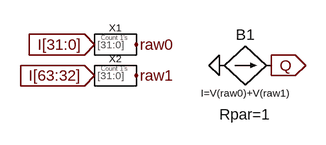
[diagram p0: schematic 1counter_64bit-fast.asc]
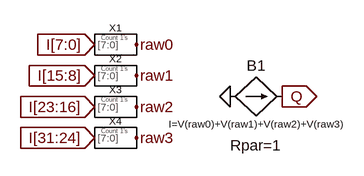
[diagram p1: sub-circuit 1counter_32bit-fast.asc]
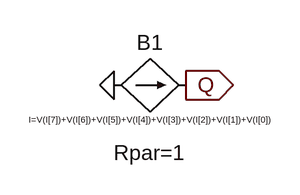
[diagram p2: sub-circuit 1counter_8bit-fast.asc]
1counter_64bit-fast.asc, the LTspice schematic file:
Version 4
SHEET 1 880 680
FLAG 432 176 Q
IOPIN 432 176 Out
FLAG 160 144 I[31:0]
IOPIN 160 144 In
FLAG 160 192 I[63:32]
IOPIN 160 192 In
FLAG 224 144 raw0
FLAG 224 192 raw1
FLAG 352 176 0
SYMBOL bi 352 176 R270
WINDOW 0 32 40 VTop 2
WINDOW 3 -32 40 VBottom 1
WINDOW 123 -60 40 VBottom 2
SYMATTR InstName B1
SYMATTR Value I=V(raw0)+V(raw1)
SYMATTR Value2 Rpar=1
SYMBOL 1counter_32bit-fast 192 144 R0
SYMATTR InstName X1
SYMBOL 1counter_32bit-fast 192 192 R0
SYMATTR InstName X2

1counter_32bit-fast.asc, the sub-circuit schematic file:
Version 4
SHEET 1 880 680
FLAG 432 176 Q
IOPIN 432 176 Out
FLAG 144 96 I[7:0]
IOPIN 144 96 In
FLAG 144 144 I[15:8]
IOPIN 144 144 In
FLAG 144 192 I[23:16]
IOPIN 144 192 In
FLAG 144 240 I[31:24]
IOPIN 144 240 In
FLAG 208 96 raw0
FLAG 208 144 raw1
FLAG 208 192 raw2
FLAG 208 240 raw3
FLAG 352 176 0
SYMBOL 1counter_8bit-fast 176 96 R0
SYMATTR InstName X1
SYMBOL 1counter_8bit-fast 176 144 R0
SYMATTR InstName X2
SYMBOL 1counter_8bit-fast 176 192 R0
SYMATTR InstName X3
SYMBOL 1counter_8bit-fast 176 240 R0
SYMATTR InstName X4
SYMBOL bi 352 176 R270
WINDOW 0 32 40 VTop 2
WINDOW 3 -32 40 VBottom 1
WINDOW 123 -60 40 VBottom 2
SYMATTR InstName B1
SYMATTR Value I=V(raw0)+V(raw1)+V(raw2)+V(raw3)
SYMATTR Value2 Rpar=1

1counter_8bit-fast.asc, the sub-circuit schematic file:
Version 4
SHEET 1 880 680
FLAG 320 128 Q
IOPIN 320 128 Out
FLAG 240 128 0
SYMBOL bi 240 128 R270
WINDOW 0 32 40 VTop 2
WINDOW 3 -32 40 VBottom 0
WINDOW 123 -60 40 VBottom 2
SYMATTR InstName B1
SYMATTR Value I=V(I[7])+V(I[6])+V(I[5])+V(I[4])+V(I[3])+V(I[2])+V(I[1])+V(I[0])
SYMATTR Value2 Rpar=1

The netlist it stands for:
* 1counter_64bit-fast.asc
B1 0 Q I=V(raw0)+V(raw1) Rpar=1
XX1 I[31] I[30] I[29] I[28] I[27] I[26] I[25] I[24] I[23] I[22] I[21] I[20] I[19] I[18] I[17] I[16] I[15] I[14] I[13] I[12] I[11] I[10] I[9] I[8] I[7] I[6] I[5] I[4] I[3] I[2] I[1] I[0] raw0 1counter_32bit-fast
XX2 I[63] I[62] I[61] I[60] I[59] I[58] I[57] I[56] I[55] I[54] I[53] I[52] I[51] I[50] I[49] I[48] I[47] I[46] I[45] I[44] I[43] I[42] I[41] I[40] I[39] I[38] I[37] I[36] I[35] I[34] I[33] I[32] raw1 1counter_32bit-fast

* block symbol definitions
.subckt 1counter_32bit-fast I[31] I[30] I[29] I[28] I[27] I[26] I[25] I[24] I[23] I[22] I[21] I[20] I[19] I[18] I[17] I[16] I[15] I[14] I[13] I[12] I[11] I[10] I[9] I[8] I[7] I[6] I[5] I[4] I[3] I[2] I[1] I[0] Q
XX1 I[7] I[6] I[5] I[4] I[3] I[2] I[1] I[0] raw0 1counter_8bit-fast
XX2 I[15] I[14] I[13] I[12] I[11] I[10] I[9] I[8] raw1 1counter_8bit-fast
XX3 I[23] I[22] I[21] I[20] I[19] I[18] I[17] I[16] raw2 1counter_8bit-fast
XX4 I[31] I[30] I[29] I[28] I[27] I[26] I[25] I[24] raw3 1counter_8bit-fast
B1 0 Q I=V(raw0)+V(raw1)+V(raw2)+V(raw3) Rpar=1
.ends 1counter_32bit-fast

.subckt 1counter_8bit-fast I[7] I[6] I[5] I[4] I[3] I[2] I[1] I[0] Q
B1 0 Q I=V(I[7])+V(I[6])+V(I[5])+V(I[4])+V(I[3])+V(I[2])+V(I[1])+V(I[0]) Rpar=1
.ends 1counter_8bit-fast

.backanno
.end